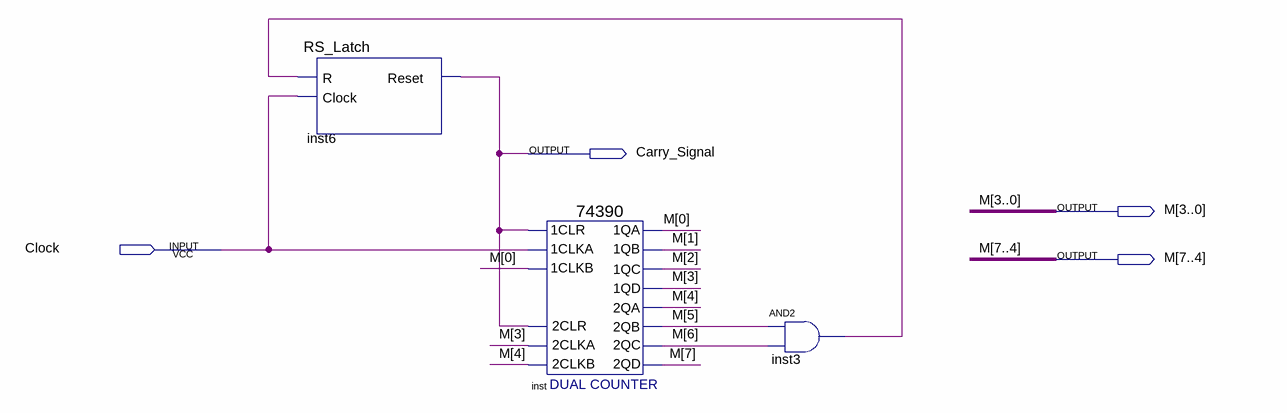
[diagram p0: schematic sheet]
// Quartus schematic Count_Minite.bdf as structural Verilog: 3 symbols, 4 pins
module Count_Minite (
  input  Clock,
  output Carry_Signal,
  output [7:0] M
);

  wire inst3_out;

  RS_Latch inst6 (.R(inst3_out), .Clock(Clock), .Reset(Carry_Signal));
  \74390  inst (
    .\2CLKA (M[3]), .\2CLR (Carry_Signal), .\2CLKB (M[4]), .\1CLR (Carry_Signal), .\1CLKA (Clock),
    .\1CLKB (M[0]), .\1QA (M[0]), .\1QB (M[1]), .\1QC (M[2]), .\1QD (M[3]), .\2QA (M[4]), .\2QB (M[5]),
    .\2QC (M[6]), .\2QD (M[7]));
  and inst3 (inst3_out, M[5], M[6]);
endmodule
